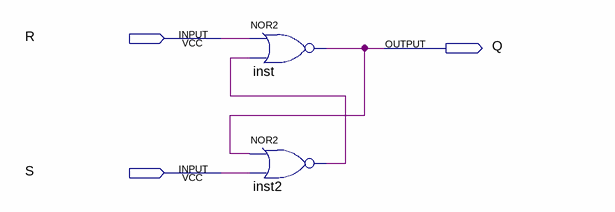
[diagram p0: schematic sheet]
// Quartus schematic scheme1.bdf as structural Verilog: 2 symbols, 3 pins
module scheme1 (
  input  R,
  input  S,
  output Q
);

  wire inst2_out;

  nor inst (Q, R, inst2_out);
  nor inst2 (inst2_out, Q, S);
endmodule
